# Altium schematic sheet main_sch.SchDoc
size A3
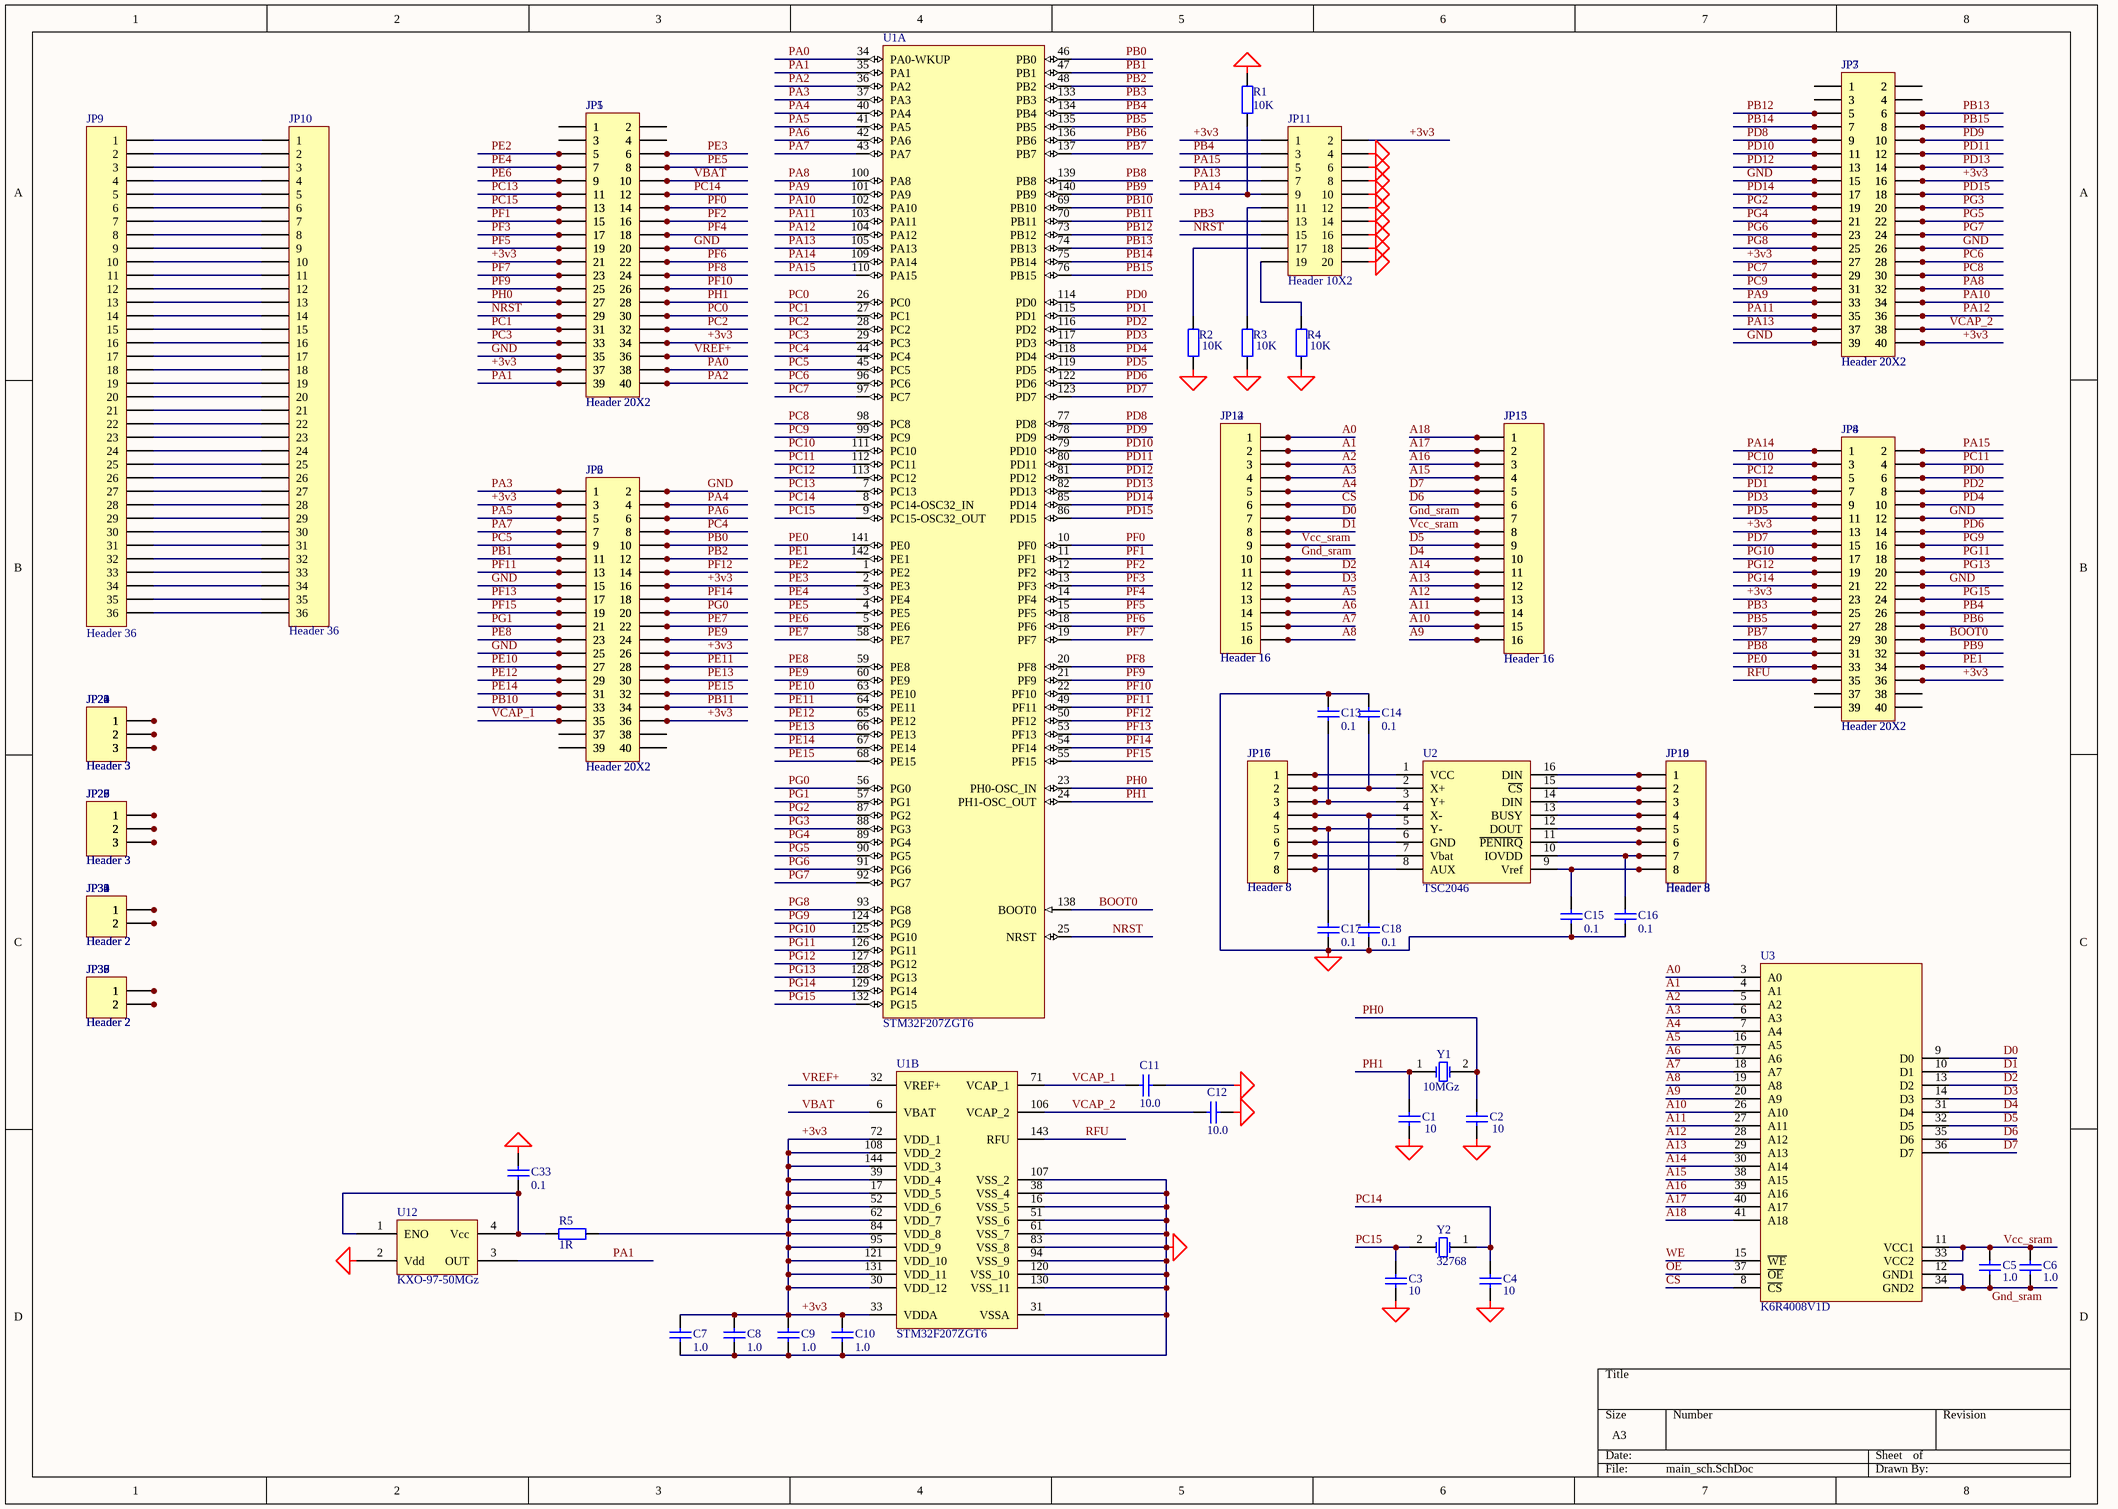
[diagram p0: main_sch.SchDoc]

## Parts
C1  10  [_1206]
C2  10  [_1206]
C3  10  [_1206]
C4  10  [_1206]
C5  1.0  [_1206]
C6  1.0  [_1206]
C7  1.0  [_1206]
C8  1.0  [_1206]
C9  1.0  [_1206]
C10  1.0  [_1206]
C11  10.0  [_1206]
C12  10.0  [_1206]
C13  0.1  [_1206]
C14  0.1  [_1206]
C15  0.1  [_1206]
C16  0.1  [_1206]
C17  0.1  [_1206]
C18  0.1  [_1206]
C33  0.1  [_1206]
JP1  Header 20X2  [HDR2X20]
JP2  Header 20X2  [HDR2X20]
JP3  Header 20X2  [HDR2X20]
JP4  Header 20X2  [HDR2X20]
JP5  Header 20X2  [HDR2X20]
JP6  Header 20X2  [HDR2X20]
JP7  Header 20X2  [HDR2X20]
JP8  Header 20X2  [HDR2X20]
JP9  Header 36  [3-1734592-6]
JP10  Header 36  [HDR2X18]
JP11  Header 10X2  [HDR2X10]
JP12  Header 16  [HDR2X8]
JP13  Header 16  [HDR2X8]
JP14  Header 16  [HDR2X8]
JP15  Header 16  [HDR2X8]
JP16  Header 8  [HDR1X8]
JP17  Header 8  [HDR1X8]
JP18  Header 8  [HDR1X8]
JP19  Header 8  [HDR1X8]
JP20  Header 3  [HDR1X3]
JP21  Header 3  [HDR1X3]
JP22  Header 3  [HDR1X3]
JP23  Header 3  [HDR1X3]
JP24  Header 3  [HDR1X3]
JP25  Header 3  [HDR1X3]
JP26  Header 3  [HDR1X3]
JP27  Header 3  [HDR1X3]
JP28  Header 3  [HDR1X3]
JP29  Header 3  [HDR1X3]
JP30  Header 2  [HDR1X2]
JP31  Header 2  [HDR1X2]
JP32  Header 2  [HDR1X2]
JP33  Header 2  [HDR1X2]
JP34  Header 2  [HDR1X2]
JP35  Header 2  [HDR1X2]
JP36  Header 2  [HDR1X2]
JP37  Header 2  [HDR1X2]
JP38  Header 2  [HDR1X2]
JP39  Header 2  [HDR1X2]
R1  10K  [_1206]
R2  10K  [_1206]
R3  10K  [_1206]
R4  10K  [_1206]
R5  1R  [_1206]
U1  STM32F207ZGT6  [F-QFP20X20-G144/N]  (parts A,B of 2)
U2  TSC2046  [TSSO5X6-G16]
U3  K6R4008V1D  [44-TSOP2]
U12  KXO-97-50MGz  [KXO-97]
Y1  10MGz  [qwarz1]
Y2  32768  [BCY-W2/D3.1]

## Nets
GND: C1.1 C2.1 C3.1 C4.1 C7.2 C8.2 C9.2 C10.2 C11.2 C12.2 C13.1 C14.1 C15.1 C16.1 C17.1 C18.1 C33.2 JP1.20 JP1.35 JP2.2 JP2.15 JP2.25 JP3.15 JP3.26 JP3.39 JP4.12 JP4.22 JP5.20 JP5.35 JP6.2 JP6.15 JP6.25 JP7.15 JP7.26 JP7.39 JP8.12 JP8.22 JP11.4 JP11.6 JP11.8 JP11.10 JP11.12 JP11.14 JP11.16 JP11.18 JP11.20 R1.2 R2.2 R3.2 R4.2 U1.16(VSS_5) U1.31(VSSA) U1.38(VSS_4) U1.51(VSS_6) U1.61(VSS_7) U1.83(VSS_8) U1.94(VSS_9) U1.107(VSS_2) U1.120(VSS_10) U1.130(VSS_11) U12.2(Vdd)
+3v3: C7.1 C8.1 C9.1 C10.1 JP1.21 JP1.34 JP1.37 JP2.3 JP2.16 JP2.26 JP2.36 JP3.16 JP3.27 JP3.40 JP4.13 JP4.23 JP4.36 JP5.21 JP5.34 JP5.37 JP6.3 JP6.16 JP6.26 JP6.36 JP7.16 JP7.27 JP7.40 JP8.13 JP8.23 JP8.36 JP11.1 JP11.2 R5.2 U1.17(VDD_5) U1.30(VDD_12) U1.33(VDDA) U1.39(VDD_4) U1.52(VDD_6) U1.62(VDD_7) U1.72(VDD_1) U1.84(VDD_8) U1.95(VDD_9) U1.108(VDD_2) U1.121(VDD_10) U1.131(VDD_11) U1.144(VDD_3)
A0: JP12.1 JP14.1 U3.3(A0)
A1: JP12.2 JP14.2 U3.4(A1)
A2: JP12.3 JP14.3 U3.5(A2)
A3: JP12.4 JP14.4 U3.6(A3)
A4: JP12.5 JP14.5 U3.7(A4)
A5: JP12.13 JP14.13 U3.16(A5)
A6: JP12.14 JP14.14 U3.17(A6)
A7: JP12.15 JP14.15 U3.18(A7)
A8: JP12.16 JP14.16 U3.19(A8)
A9: JP13.16 JP15.16 U3.20(A9)
A10: JP13.15 JP15.15 U3.26(A10)
A11: JP13.14 JP15.14 U3.27(A11)
A12: JP13.13 JP15.13 U3.28(A12)
A13: JP13.12 JP15.12 U3.29(A13)
A14: JP13.11 JP15.11 U3.30(A14)
A15: JP13.4 JP15.4 U3.38(A15)
A16: JP13.3 JP15.3 U3.39(A16)
A17: JP13.2 JP15.2 U3.40(A17)
A18: JP13.1 JP15.1 U3.41(A18)
BOOT0: JP4.30 JP8.30 U1.138(BOOT0)
CS: JP12.6 JP14.6 U3.8(~{CS})
D0: JP12.7 JP14.7 U3.9(D0)
D1: JP12.8 JP14.8 U3.10(D1)
D2: JP12.11 JP14.11 U3.13(D2)
D3: JP12.12 JP14.12 U3.14(D3)
D4: JP13.10 JP15.10 U3.31(D4)
D5: JP13.9 JP15.9 U3.32(D5)
D6: JP13.6 JP15.6 U3.35(D6)
D7: JP13.5 JP15.5 U3.36(D7)
Gnd_sram: C5.1 C6.1 JP12.10 JP13.7 JP14.10 JP15.7 U3.12(GND1) U3.34(GND2)
NRST: JP1.29 JP5.29 JP11.15 U1.25(NRST)
OE: U3.37(~{OE})
PA0: JP1.38 JP5.38 U1.34(PA0-WKUP)
PA1: JP1.39 JP5.39 U1.35(PA1) U12.3(OUT)
PA2: JP1.40 JP5.40 U1.36(PA2)
PA3: JP2.1 JP6.1 U1.37(PA3)
PA4: JP2.4 JP6.4 U1.40(PA4)
PA5: JP2.5 JP6.5 U1.41(PA5)
PA6: JP2.6 JP6.6 U1.42(PA6)
PA7: JP2.7 JP6.7 U1.43(PA7)
PA8: JP3.32 JP7.32 U1.100(PA8)
PA9: JP3.33 JP7.33 U1.101(PA9)
PA10: JP3.34 JP7.34 U1.102(PA10)
PA11: JP3.35 JP7.35 U1.103(PA11)
PA12: JP3.36 JP7.36 U1.104(PA12)
PA13: JP3.37 JP7.37 JP11.7 U1.105(PA13)
PA14: JP4.1 JP8.1 JP11.9 R1.1 U1.109(PA14)
PA15: JP4.2 JP8.2 JP11.5 U1.110(PA15)
PB0: JP2.10 JP6.10 U1.46(PB0)
PB1: JP2.11 JP6.11 U1.47(PB1)
PB2: JP2.12 JP6.12 U1.48(PB2)
PB3: JP4.25 JP8.25 JP11.13 U1.133(PB3)
PB4: JP4.26 JP8.26 JP11.3 U1.134(PB4)
PB5: JP4.27 JP8.27 U1.135(PB5)
PB6: JP4.28 JP8.28 U1.136(PB6)
PB7: JP4.29 JP8.29 U1.137(PB7)
PB8: JP4.31 JP8.31 U1.139(PB8)
PB9: JP4.32 JP8.32 U1.140(PB9)
PB10: JP2.33 JP6.33 U1.69(PB10)
PB11: JP2.34 JP6.34 U1.70(PB11)
PB12: JP3.5 JP7.5 U1.73(PB12)
PB13: JP3.6 JP7.6 U1.74(PB13)
PB14: JP3.7 JP7.7 U1.75(PB14)
PB15: JP3.8 JP7.8 U1.76(PB15)
PC0: JP1.30 JP5.30 U1.26(PC0)
PC1: JP1.31 JP5.31 U1.27(PC1)
PC2: JP1.32 JP5.32 U1.28(PC2)
PC3: JP1.33 JP5.33 U1.29(PC3)
PC4: JP2.8 JP6.8 U1.44(PC4)
PC5: JP2.9 JP6.9 U1.45(PC5)
PC6: JP3.28 JP7.28 U1.96(PC6)
PC7: JP3.29 JP7.29 U1.97(PC7)
PC8: JP3.30 JP7.30 U1.98(PC8)
PC9: JP3.31 JP7.31 U1.99(PC9)
PC10: JP4.3 JP8.3 U1.111(PC10)
PC11: JP4.4 JP8.4 U1.112(PC11)
PC12: JP4.5 JP8.5 U1.113(PC12)
PC13: JP1.11 JP5.11 U1.7(PC13)
PC14: C4.2 JP1.12 JP5.12 U1.8(PC14-OSC32_IN) Y2.1(OSC1)
PC15: C3.2 JP1.13 JP5.13 U1.9(PC15-OSC32_OUT) Y2.2(OSC2)
PD0: JP4.6 JP8.6 U1.114(PD0)
PD1: JP4.7 JP8.7 U1.115(PD1)
PD2: JP4.8 JP8.8 U1.116(PD2)
PD3: JP4.9 JP8.9 U1.117(PD3)
PD4: JP4.10 JP8.10 U1.118(PD4)
PD5: JP4.11 JP8.11 U1.119(PD5)
PD6: JP4.14 JP8.14 U1.122(PD6)
PD7: JP4.15 JP8.15 U1.123(PD7)
PD8: JP3.9 JP7.9 U1.77(PD8)
PD9: JP3.10 JP7.10 U1.78(PD9)
PD10: JP3.11 JP7.11 U1.79(PD10)
PD11: JP3.12 JP7.12 U1.80(PD11)
PD12: JP3.13 JP7.13 U1.81(PD12)
PD13: JP3.14 JP7.14 U1.82(PD13)
PD14: JP3.17 JP7.17 U1.85(PD14)
PD15: JP3.18 JP7.18 U1.86(PD15)
PE0: JP4.33 JP8.33 U1.141(PE0)
PE1: JP4.34 JP8.34 U1.142(PE1)
PE2: JP1.5 JP5.5 U1.1(PE2)
PE3: JP1.6 JP5.6 U1.2(PE3)
PE4: JP1.7 JP5.7 U1.3(PE4)
PE5: JP1.8 JP5.8 U1.4(PE5)
PE6: JP1.9 JP5.9 U1.5(PE6)
PE7: JP2.22 JP6.22 U1.58(PE7)
PE8: JP2.23 JP6.23 U1.59(PE8)
PE9: JP2.24 JP6.24 U1.60(PE9)
PE10: JP2.27 JP6.27 U1.63(PE10)
PE11: JP2.28 JP6.28 U1.64(PE11)
PE12: JP2.29 JP6.29 U1.65(PE12)
PE13: JP2.30 JP6.30 U1.66(PE13)
PE14: JP2.31 JP6.31 U1.67(PE14)
PE15: JP2.32 JP6.32 U1.68(PE15)
PF0: JP1.14 JP5.14 U1.10(PF0)
PF1: JP1.15 JP5.15 U1.11(PF1)
PF2: JP1.16 JP5.16 U1.12(PF2)
PF3: JP1.17 JP5.17 U1.13(PF3)
PF4: JP1.18 JP5.18 U1.14(PF4)
PF5: JP1.19 JP5.19 U1.15(PF5)
PF6: JP1.22 JP5.22 U1.18(PF6)
PF7: JP1.23 JP5.23 U1.19(PF7)
PF8: JP1.24 JP5.24 U1.20(PF8)
PF9: JP1.25 JP5.25 U1.21(PF9)
PF10: JP1.26 JP5.26 U1.22(PF10)
PF11: JP2.13 JP6.13 U1.49(PF11)
PF12: JP2.14 JP6.14 U1.50(PF12)
PF13: JP2.17 JP6.17 U1.53(PF13)
PF14: JP2.18 JP6.18 U1.54(PF14)
PF15: JP2.19 JP6.19 U1.55(PF15)
PG0: JP2.20 JP6.20 U1.56(PG0)
PG1: JP2.21 JP6.21 U1.57(PG1)
PG2: JP3.19 JP7.19 U1.87(PG2)
PG3: JP3.20 JP7.20 U1.88(PG3)
PG4: JP3.21 JP7.21 U1.89(PG4)
PG5: JP3.22 JP7.22 U1.90(PG5)
PG6: JP3.23 JP7.23 U1.91(PG6)
PG7: JP3.24 JP7.24 U1.92(PG7)
PG8: JP3.25 JP7.25 U1.93(PG8)
PG9: JP4.16 JP8.16 U1.124(PG9)
PG10: JP4.17 JP8.17 U1.125(PG10)
PG11: JP4.18 JP8.18 U1.126(PG11)
PG12: JP4.19 JP8.19 U1.127(PG12)
PG13: JP4.20 JP8.20 U1.128(PG13)
PG14: JP4.21 JP8.21 U1.129(PG14)
PG15: JP4.24 JP8.24 U1.132(PG15)
PH0: C2.2 JP1.27 JP5.27 U1.23(PH0-OSC_IN) Y1.2(OSC2)
PH1: C1.2 JP1.28 JP5.28 U1.24(PH1-OSC_OUT) Y1.1(OSC1)
RFU: JP4.35 JP8.35 U1.143(RFU)
VBAT: JP1.10 JP5.10 U1.6(VBAT)
VCAP_1: C11.1 JP2.35 JP6.35 U1.71(VCAP_1)
VCAP_2: C12.1 JP3.38 JP7.38 U1.106(VCAP_2)
Vcc_sram: C5.2 C6.2 JP12.9 JP13.8 JP14.9 JP15.8 U3.11(VCC1) U3.33(VCC2)
VREF+: JP1.36 JP5.36 U1.32(VREF+)
WE: U3.15(~{WE})
NetC13_2: C13.2 JP16.3 JP17.3 U2.3(Y+)
NetC14_2: C14.2 JP16.2 JP17.2 U2.2(X+)
NetC15_2: C15.2 JP18.8 JP19.8 U2.9(Vref)
NetC16_2: C16.2 JP18.7 JP19.7 U2.10(IOVDD)
NetC17_2: C17.2 JP16.5 JP17.5 U2.5(Y-)
NetC18_2: C18.2 JP16.4 JP17.4 U2.4(X-)
NetC33_1: C33.1 R5.1 U12.1(ENO) U12.4(Vcc)
NetJP1_1: JP1.1 JP5.1
NetJP1_2: JP1.2 JP5.2
NetJP1_3: JP1.3 JP5.3
NetJP1_4: JP1.4 JP5.4
NetJP2_37: JP2.37 JP6.37
NetJP2_38: JP2.38 JP6.38
NetJP2_39: JP2.39 JP6.39
NetJP2_40: JP2.40 JP6.40
NetJP3_1: JP3.1 JP7.1
NetJP3_2: JP3.2 JP7.2
NetJP3_3: JP3.3 JP7.3
NetJP3_4: JP3.4 JP7.4
NetJP4_37: JP4.37 JP8.37
NetJP4_38: JP4.38 JP8.38
NetJP4_39: JP4.39 JP8.39
NetJP4_40: JP4.40 JP8.40
NetJP9_1: JP9.1 JP10.1
NetJP9_2: JP9.2 JP10.2
NetJP9_3: JP9.3 JP10.3
NetJP9_4: JP9.4 JP10.4
NetJP9_5: JP9.5 JP10.5
NetJP9_6: JP9.6 JP10.6
NetJP9_7: JP9.7 JP10.7
NetJP9_8: JP9.8 JP10.8
NetJP9_9: JP9.9 JP10.9
NetJP9_10: JP9.10 JP10.10
NetJP9_11: JP9.11 JP10.11
NetJP9_12: JP9.12 JP10.12
NetJP9_13: JP9.13 JP10.13
NetJP9_14: JP9.14 JP10.14
NetJP9_15: JP9.15 JP10.15
NetJP9_16: JP9.16 JP10.16
NetJP9_17: JP9.17 JP10.17
NetJP9_18: JP9.18 JP10.18
NetJP9_19: JP9.19 JP10.19
NetJP9_20: JP9.20 JP10.20
NetJP9_21: JP9.21 JP10.21
NetJP9_22: JP9.22 JP10.22
NetJP9_23: JP9.23 JP10.23
NetJP9_24: JP9.24 JP10.24
NetJP9_25: JP9.25 JP10.25
NetJP9_26: JP9.26 JP10.26
NetJP9_27: JP9.27 JP10.27
NetJP9_28: JP9.28 JP10.28
NetJP9_29: JP9.29 JP10.29
NetJP9_30: JP9.30 JP10.30
NetJP9_31: JP9.31 JP10.31
NetJP9_32: JP9.32 JP10.32
NetJP9_33: JP9.33 JP10.33
NetJP9_34: JP9.34 JP10.34
NetJP9_35: JP9.35 JP10.35
NetJP9_36: JP9.36 JP10.36
NetJP11_11: JP11.11 R3.1
NetJP11_17: JP11.17 R2.1
NetJP11_19: JP11.19 R4.1
NetJP16_1: JP16.1 JP17.1 U2.1(VCC)
NetJP16_6: JP16.6 JP17.6 U2.6(GND)
NetJP16_7: JP16.7 JP17.7 U2.7(Vbat)
NetJP16_8: JP16.8 JP17.8 U2.8(AUX)
NetJP18_1: JP18.1 JP19.1 U2.16(DIN)
NetJP18_2: JP18.2 JP19.2 U2.15(~{CS})
NetJP18_3: JP18.3 JP19.3 U2.14(DIN)
NetJP18_4: JP18.4 JP19.4 U2.13(BUSY)
NetJP18_5: JP18.5 JP19.5 U2.12(DOUT)
NetJP18_6: JP18.6 JP19.6 U2.11(~{PENIRQ})
NetJP20_1: JP20.1 JP21.1 JP22.1 JP23.1 JP24.1
NetJP20_2: JP20.2 JP21.2 JP22.2 JP23.2 JP24.2
NetJP20_3: JP20.3 JP21.3 JP22.3 JP23.3 JP24.3
NetJP25_1: JP25.1 JP26.1 JP27.1 JP28.1 JP29.1
NetJP25_2: JP25.2 JP26.2 JP27.2 JP28.2 JP29.2
NetJP25_3: JP25.3 JP26.3 JP27.3 JP28.3 JP29.3
NetJP30_1: JP30.1 JP31.1 JP32.1 JP33.1 JP34.1
NetJP30_2: JP30.2 JP31.2 JP32.2 JP33.2 JP34.2
NetJP35_1: JP35.1 JP36.1 JP37.1 JP38.1 JP39.1
NetJP35_2: JP35.2 JP36.2 JP37.2 JP38.2 JP39.2

## Library data of the parts
C1-C18 = Cap Semi: Capacitor; Manufacturer: Generic Components; Class I: Passive; Value: 0,1; Published: 8-Jun-2000; Revision: July-2002: Re-released for DXP Platform.; Publisher: Altium Limited; Class II: Capacitor
C33 = Cap Semi: Capacitor (Semiconductor SIM Model); Manufacturer: Generic Components; Class I: Passive; Value: 1,0; Published: 8-Jun-2000; Revision: July-2002: Re-released for DXP Platform.; Publisher: Altium Limited; Class II: Capacitor
JP1-JP8 = Header 20X2: Header, 20-Pin, Dual row; Manufacturer: Generic Components; Class I: Connector; Revision: July-2002: Re-released for DXP Platform.; Publisher: Altium Limited
JP9 JP10 = Header 36: Header, 36-Pin; Manufacturer: Generic Components; Class I: Connector; Revision: July-2002: Re-released for DXP Platform.; Publisher: Altium Limited
JP11 = Header 10X2: Header, 10-Pin, Dual row; Manufacturer: Generic Components; Class I: Connector; Revision: July-2002: Re-released for DXP Platform.; Publisher: Altium Limited
JP12-JP15 = Header 16: Header, 16-Pin; Manufacturer: Generic Components; Class I: Connector; Revision: July-2002: Re-released for DXP Platform.; Publisher: Altium Limited
JP16-JP19 = Header 8: Header, 8-Pin; Manufacturer: Generic Components; Class I: Connector; Revision: July-2002: Re-released for DXP Platform.; Publisher: Altium Limited
JP20-JP29 = Header 3: Header, 3-Pin; Manufacturer: Generic Components; Class I: Connector; Revision: July-2002: Re-released for DXP Platform.; Publisher: Altium Limited
JP30-JP39 = Header 2: Header, 2-Pin; Manufacturer: Generic Components; Class I: Connector; Revision: July-2002: Re-released for DXP Platform.; Publisher: Altium Limited
R1-R4 = Res2: Resistor; Manufacturer: Generic Components; Class I: Passive; Published: 8-Jun-2000; Revision: July-2002: Re-released for DXP Platform.; Publisher: Altium Limited; Class II: Resistor; Value: 10K
R5 = Res2: Resistor; Manufacturer: Generic Components; Class I: Passive; Value: 10K; Rule: Undefined; Published: 8-Jun-2000; Revision: July-2002: Re-released for DXP Platform.; Publisher: Altium Limited; Class II: Resistor
U1 = STM32F207ZGT6: STM32 ARM-based 32-bit MCU Connectivity Line & Ethernet with 1024 kB Flash, 128 kB Internal RAM, -40 to +85°C Temperature, 144-Pin LQFP, Tray; DatasheetVersion: rev6.0, Apr-2011; PackageVersion: 2011; PackageReference: LQFP144; PackageDescription: 144-Pin Thin Quad Flat Pack 0.5 mm Pitch; ComponentLink1Description: Manufacturer URL; ComponentLink1URL: http://www.st.com/; ComponentLink2Description: STM32F205/207 Datasheet; ComponentLink2URL: http://www.st.com/internet/com/TECHNICAL_RESOURCES/TECHNICAL_LITERATURE/DATASHEET/CD00237391.pdf; ComponentLink3Description: STM32 Family Web Page; ComponentLink3URL: www.st.com/stm32
U12 = KXO-97
Y1 Y2 = XTAL: Crystal Oscillator; Manufacturer: Generic Components; Published: 8-Jun-2000; Revision: July-2002: Re-released for DXP Platform.; Publisher: Altium Limited; Class I: Oscillator; Class II: Crystal Oscillator